# EAGLE schematic Domuino R (EAGLE 7.6.0)
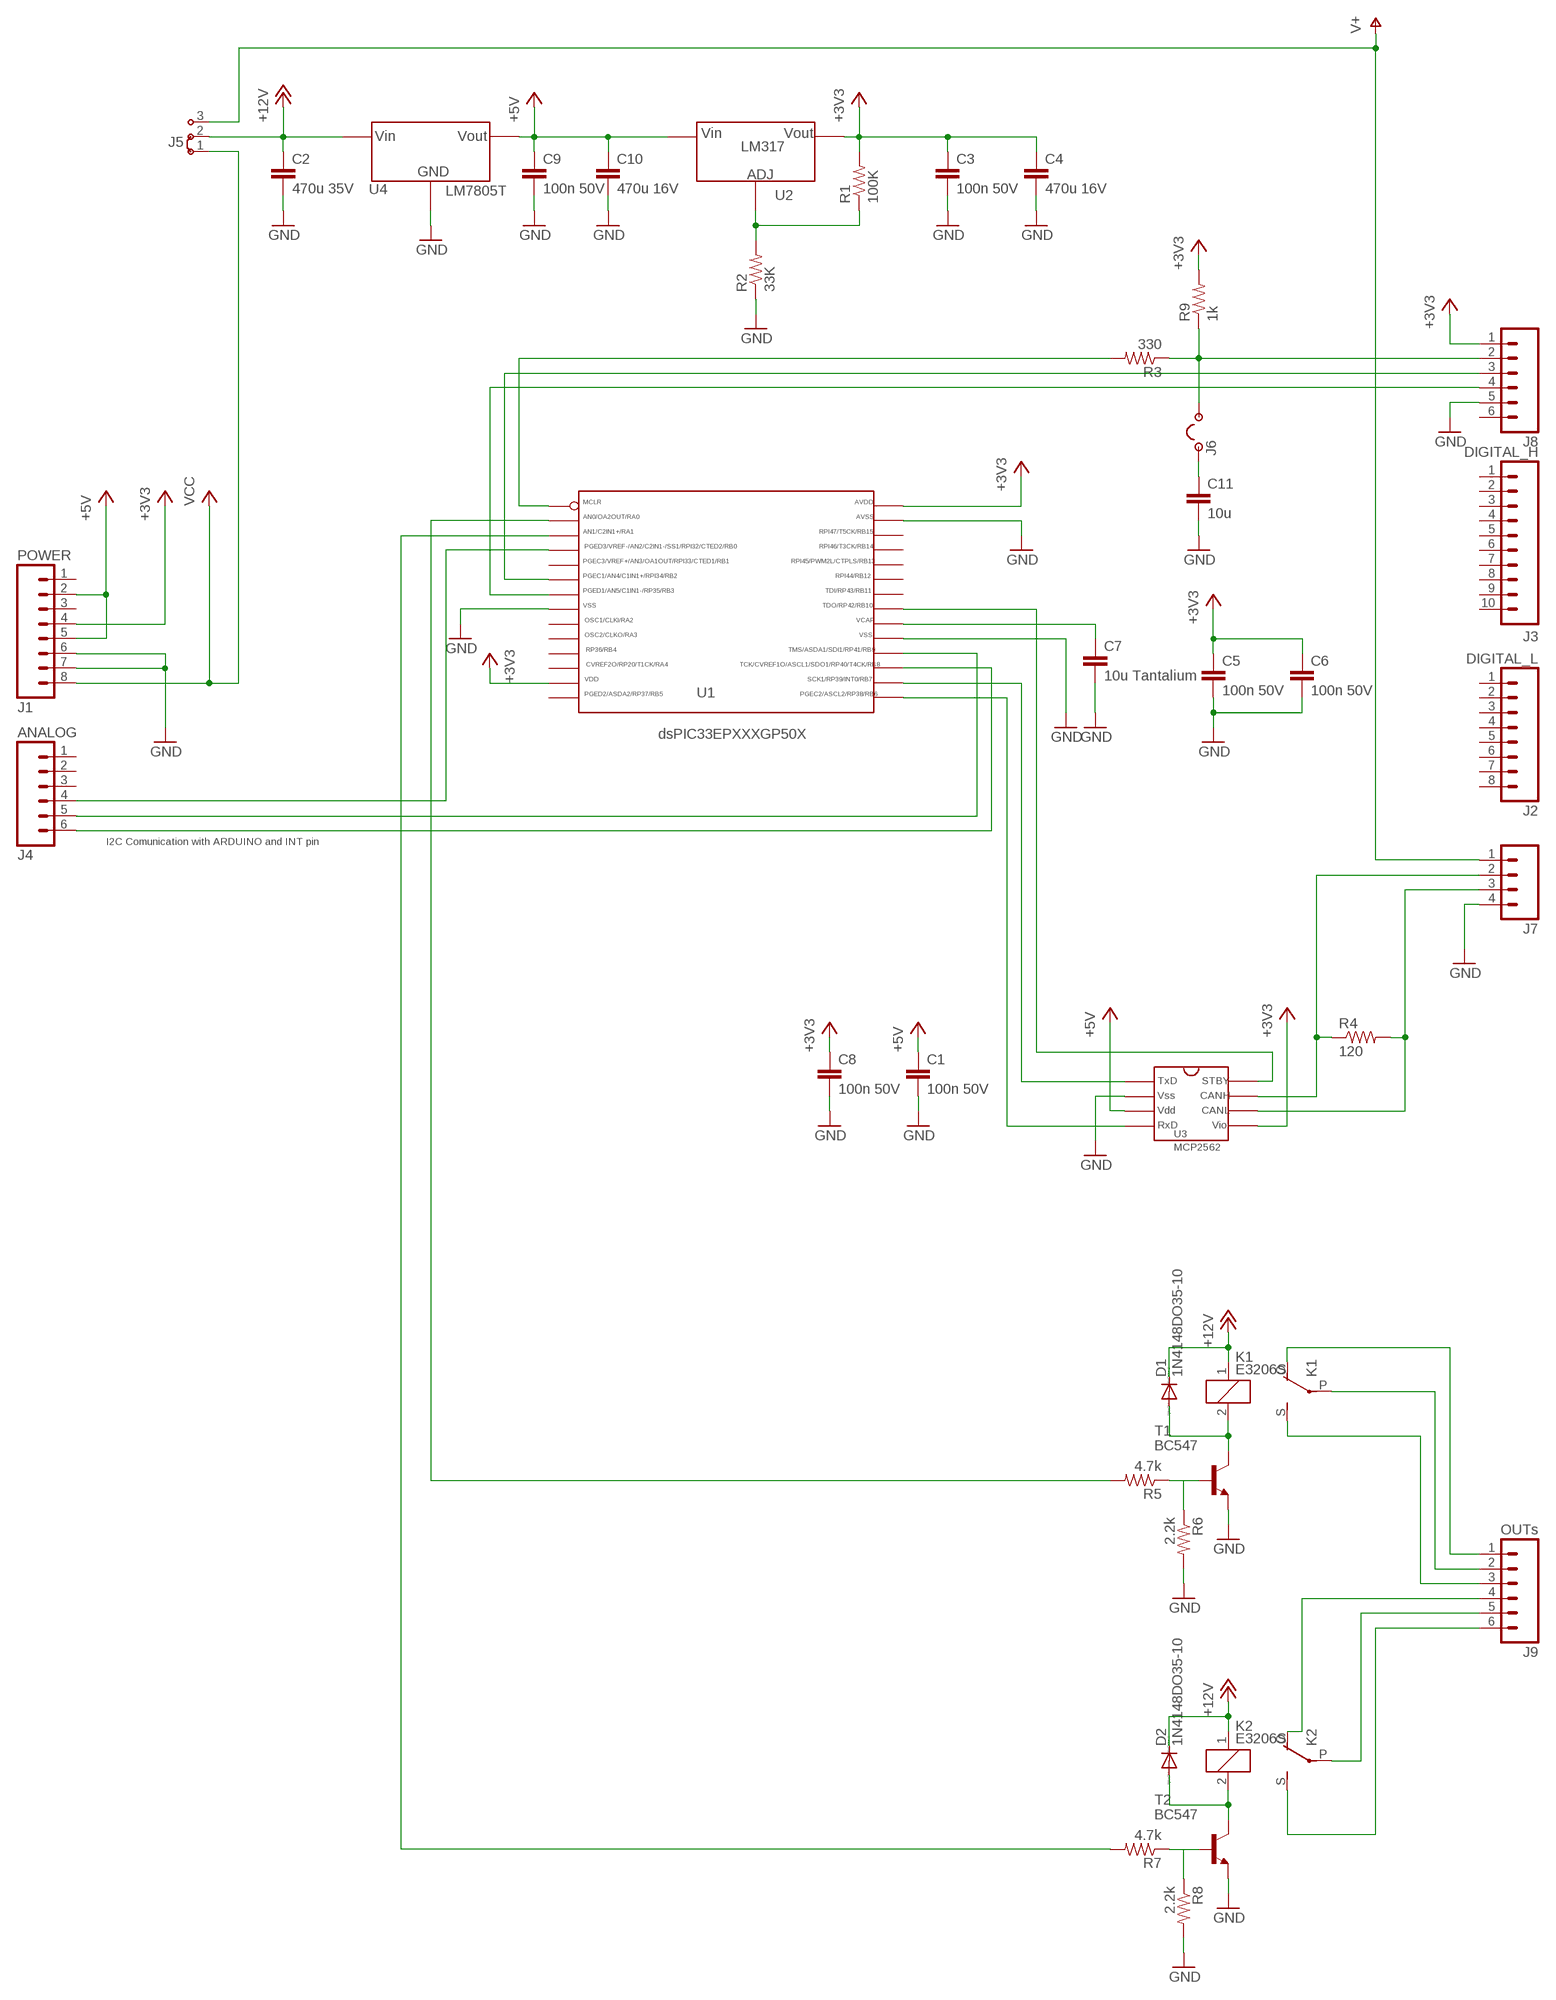
[diagram p0: schematic, sheet 1]

## Parts
C1  100n 50V  0.1UF-50V-20%(PTH)KIT-EZ  [CAP-PTH-SMALL-KIT]
C2  470u 35V  0.1UF-50V-20%(PTH)KIT-EZ  [CAP-PTH-SMALL-KIT]
C3  100n 50V  0.1UF-50V-20%(PTH)KIT-EZ  [CAP-PTH-SMALL-KIT]
C4  470u 16V  0.1UF-50V-20%(PTH)KIT-EZ  [CAP-PTH-SMALL-KIT]
C5  100n 50V  0.1UF-50V-20%(PTH)KIT-EZ  [CAP-PTH-SMALL-KIT]
C6  100n 50V  0.1UF-50V-20%(PTH)KIT-EZ  [CAP-PTH-SMALL-KIT]
C7  10u Tantalium  0.1UF-50V-20%(PTH)KIT-EZ  [CAP-PTH-SMALL-KIT]
C8  100n 50V  0.1UF-50V-20%(PTH)KIT-EZ  [CAP-PTH-SMALL-KIT]
C9  100n 50V  0.1UF-50V-20%(PTH)KIT-EZ  [CAP-PTH-SMALL-KIT]
C10  470u 16V  0.1UF-50V-20%(PTH)KIT-EZ  [CAP-PTH-SMALL-KIT]
C11  10u  0.1UF-50V-20%(PTH)KIT-EZ  [CAP-PTH-SMALL-KIT]
D1  1N4148DO35-10  [DO35-10]
D2  1N4148DO35-10  [DO35-10]
J1  POWER  M08  [1X08_ROUND]
J2  DIGITAL_L  M08  [1X08_ROUND]
J3  DIGITAL_H  M10SILK_FEMALE_PTH  [1X10]
J4  ANALOG  M06NO_SILK_FEMALE_PTH  [1X06_NO_SILK]
J5  J2X5MM  [05C]
J6  JUMPER2  [JUMPER2]
J7  M04POLAR  [MOLEX-1X4]
J8  M06NO_SILK_FEMALE_PTH  [1X06_NO_SILK]
J9  OUTs  M06NO_SILK_FEMALE_PTH  [1X06_NO_SILK]
K1  E3206S  [E3206S]
K2  E3206S  [E3206S]
R1  100K  100KOHM-1/4W-1%(PTH)HORIZ  [AXIAL-0.3]
R2  33K  100KOHM-1/4W-1%(PTH)HORIZ  [AXIAL-0.3]
R3  330  100KOHM-1/4W-1%(PTH)HORIZ  [AXIAL-0.3]
R4  120  100KOHM-1/4W-1%(PTH)HORIZ  [AXIAL-0.3]
R5  4.7k  100KOHM-1/4W-1%(PTH)HORIZ  [AXIAL-0.3]
R6  2.2k  100KOHM-1/4W-1%(PTH)HORIZ  [AXIAL-0.3]
R7  4.7k  100KOHM-1/4W-1%(PTH)HORIZ  [AXIAL-0.3]
R8  2.2k  100KOHM-1/4W-1%(PTH)HORIZ  [AXIAL-0.3]
R9  1k  100KOHM-1/4W-1%(PTH)HORIZ  [AXIAL-0.3]
T1  BC547  [TO92]
T2  BC547  [TO92]
U1  DSPIC33EPXXXGP50X_SPDIP  [SPDIP-28PIN]
U2  LM317_TO220  [TO220]
U3  MCP2562_RDIP-8PIN  [RPDIP-8PIN]
U4  LM7805T_TO220  [TO220]

## Nets
+3V3: C3.1 C4.1 C5.1 C6.1 C8.1 J1.4 J8.1 R1.P$2 R9.P$2 U1.P$13 U1.P$28 U2.P$2 U3.P$5
+5V: C1.1 C9.1 C10.1 J1.2 J1.5 U2.P$3 U3.P$3 U4.P$3
+12V: C2.1 D1.C D2.C J5.2 K1.1 K2.1 U4.P$1
GND: C1.2 C2.2 C3.2 C4.2 C5.2 C6.2 C7.2 C8.2 C9.2 C10.2 C11.2 J1.6 J1.7 J7.4 J8.5 R2.P$1 R6.P$2 R8.P$2 T1.1(E) T2.1(E) U1.P$8 U1.P$19 U1.P$27 U3.P$2 U4.P$2
N$1: D2.A K2.2 T2.3(C)
N$2: R1.P$1 R2.P$2 U2.P$1
N$3: J4.6 U1.P$17
N$4: D1.A K1.2 T1.3(C)
N$5: J4.5 U1.P$18
N$6: J4.4 U1.P$4
N$7: R3.P$2 U1.P$1
N$8: J8.3 U1.P$6
N$9: J8.4 U1.P$7
N$10: J7.2 R4.P$1 U3.P$7
N$11: J7.3 R4.P$2 U3.P$6
N$12: U1.P$16 U3.P$1
N$13: U1.P$15 U3.P$4
N$14: R5.P$1 R6.P$1 T1.2(B)
N$15: U1.P$21 U3.P$8
N$16: J6.P$2 J8.2 R3.P$1 R9.P$1
N$17: R7.P$1 R8.P$1 T2.2(B)
N$18: J9.2 K1.P(2:P)
N$19: J9.1 K1.O(2:O)
N$20: J9.3 K1.S(2:S)
N$21: J9.4 K2.O(2:O)
N$22: J9.5 K2.P(2:P)
N$23: J9.6 K2.S(2:S)
N$24: R5.P$2 U1.P$2
N$25: R7.P$2 U1.P$3
N$26: C11.1
N$27: C7.1 U1.P$20
V+: J5.3 J7.1
VCC: J1.8 J5.1
Unconnected: J1.1 J1.3 J2.1 J2.2 J2.3 J2.4 J2.5 J2.6 J2.7 J2.8 J3.1 J3.2 J3.3 J3.4 J3.5 J3.6 J3.7 J3.8 J3.9 J3.10 J4.1 J4.2 J4.3 J6.P$1 J8.6 U1.P$5 U1.P$9 U1.P$10 U1.P$11 U1.P$12 U1.P$14 U1.P$22 U1.P$23 U1.P$24 U1.P$25 U1.P$26

## Notes on the sheet
- I2C Comunication with ARDUINO and INT pin

## Library data of the parts
C1-C11 = SparkFun-Capacitors:0.1UF-50V-20%(PTH): CAP-08370; PROD_ID: CAP-08370
D1 D2 = diode:1N4148: DIODE high speed (Philips)
J1 = SparkFun-Connectors:M08: Header 8 Standard 8-pin 0.1" header. Use with straight break away headers (SKU : PRT-00116), right angle break away headers (PRT-00553), swiss pins (PRT-00743), machine pins (PRT-00117), and female headers (PRT-00115).; PROD_ID: POWER
J2 = SparkFun-Connectors:M08: Header 8 Standard 8-pin 0.1" header. Use with straight break away headers (SKU : PRT-00116), right angle break away headers (PRT-00553), swiss pins (PRT-00743), machine pins (PRT-00117), and female headers (PRT-00115).; PROD_ID: CONN-08437
J3 = SparkFun-Connectors:M10: Header 10 Standard 10-pin 0.1" header. Use with straight break away headers (SKU : PRT-00116), right angle break away headers (PRT-00553), swiss pins (PRT-00743), machine pins (PRT-00117), and female headers (PRT-00115).; PROD_ID: CONN-11563
J4 J8 J9 = SparkFun-Connectors:M06: Header 6 Standard 6-pin 0.1" header. Use with straight break away headers (SKU : PRT-00116), right angle break away headers (PRT-00553), swiss pins (PRT-00743), machine pins (PRT-00117), and female headers (PRT-00115). Molex polarized connector foot print use with SKU : PRT-08094 with associated crimp pins and housings. NOTES ON THE VARIANTS LOCK and LOCK_LONGPADS... This footprint was designed to help hold the alignment of a through-hole component (i.e. 6-pin header) while soldering it into place. You may notice that each hole has been shifted either up or down by 0.005 of an inch from it's more standard position (which is a perfectly straight line). This slight alteration caused the pins (the squares in the middle) to touch the edges of the holes. Because they are alternating, it causes a "brace" to hold the component in place. 0.005 has proven to be the perfect amount of "off-center" position when using our standard breakaway headers. Although looks a little odd when you look at the bare footprint, once you have a header in there, the alteration is very hard to notice. Also,if you push a header all the way into place, it is covered up entirely on the bottom side. This idea of altering the position of holes to aid alignment will be further integrated into the Sparkfun Library for other footprints. It can help hold any component with 3 or more connection pins.; PROD_ID: CONN-08437
J5 = jumper:J2: Jumper switch 2 x 2.5 mm
J6 = Luca:JUMPER2
J7 = SparkFun-Connectors:M04: Header 4 Standard 4-pin 0.1" header. Use with straight break away headers (SKU : PRT-00116), right angle break away headers (PRT-00553), swiss pins (PRT-00743), machine pins (PRT-00117), and female headers (PRT-00115). Molex polarized connector foot print use with SKU : PRT-08231 with associated crimp pins and housings. 1MM SMD Version SKU: PRT-10208
K1 K2 = relay:E3206S: RELAY 1 x switch, Eichhoff/distributor Schukat; OC_FARNELL: unknown; OC_NEWARK: unknown
R1 = SparkFun-Resistors:100KOHM-1/4W-1%(PTH): RES-12184; PROD_ID: RES-12184
R2-R9 = SparkFun-Resistors:100KOHM-1/4W-1%(PTH): RES-12184; PROD_ID: RES-12184; VALUE: 100K
T1 T2 = transistor:BC547: NPN TRANSISTOR
U1 = Luca:DSPIC33EPXXXGP50X
U2 = Luca:LM317
U3 = Luca:MCP2562
U4 = Luca:LM7805T